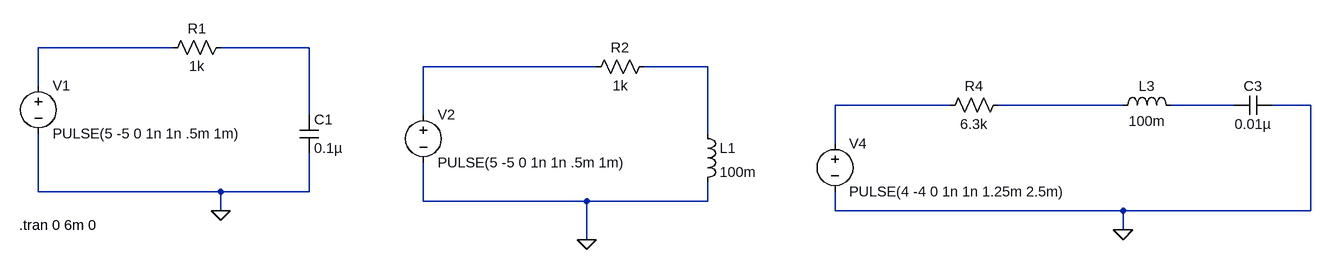
[diagram p0: schematic lab-four-RLC.asc]
lab-four-RLC.asc, the LTspice schematic file:
Version 4.1
SHEET 1 3908 1336
WIRE -176 -80 -400 -80
WIRE 128 -80 -96 -80
WIRE 848 -48 560 -48
WIRE 1104 -48 928 -48
WIRE -400 -16 -400 -80
WIRE 3248 16 3056 16
WIRE 3536 16 3328 16
WIRE 3776 16 3616 16
WIRE 3904 16 3840 16
WIRE 128 32 128 -80
WIRE 560 32 560 -48
WIRE 1104 64 1104 -48
WIRE 3056 80 3056 16
WIRE -400 160 -400 64
WIRE -96 160 -400 160
WIRE 128 160 128 96
WIRE 128 160 -96 160
WIRE 560 176 560 112
WIRE 832 176 560 176
WIRE 1104 176 1104 144
WIRE 1104 176 832 176
WIRE -96 192 -96 160
WIRE 3056 192 3056 160
WIRE 3536 192 3056 192
WIRE 3904 192 3904 16
WIRE 3904 192 3536 192
WIRE 3536 224 3536 192
WIRE 832 240 832 176
FLAG -96 192 0
FLAG 832 240 0
FLAG 3536 224 0
SYMBOL voltage -400 -32 R0
WINDOW 123 0 0 Left 0
WINDOW 39 0 0 Left 0
SYMATTR InstName V1
SYMATTR Value PULSE(5 -5 0 1n 1n .5m 1m)
SYMBOL res -80 -96 R90
WINDOW 0 0 56 VBottom 2
WINDOW 3 32 56 VTop 2
SYMATTR InstName R1
SYMATTR Value 1k
SYMBOL cap 112 32 R0
SYMATTR InstName C1
SYMATTR Value 0.1µ
SYMBOL voltage 560 16 R0
WINDOW 123 0 0 Left 0
WINDOW 39 0 0 Left 0
SYMATTR InstName V2
SYMATTR Value PULSE(5 -5 0 1n 1n .5m 1m)
SYMBOL res 944 -64 R90
WINDOW 0 0 56 VBottom 2
WINDOW 3 32 56 VTop 2
SYMATTR InstName R2
SYMATTR Value 1k
SYMBOL ind 1088 48 R0
SYMATTR InstName L1
SYMATTR Value 100m
SYMATTR SpiceLine Rser=1m
SYMBOL voltage 3056 64 R0
WINDOW 123 0 0 Left 0
WINDOW 39 0 0 Left 0
SYMATTR InstName V4
SYMATTR Value PULSE(4 -4 0 1n 1n 1.25m 2.5m)
SYMBOL res 3344 0 R90
WINDOW 0 0 56 VBottom 2
WINDOW 3 32 56 VTop 2
SYMATTR InstName R4
SYMATTR Value 6.3k
SYMBOL ind 3520 32 R270
WINDOW 0 32 56 VTop 2
WINDOW 3 5 56 VBottom 2
SYMATTR InstName L3
SYMATTR Value 100m
SYMATTR SpiceLine Rser=1m
SYMBOL cap 3840 0 R90
WINDOW 0 0 32 VBottom 2
WINDOW 3 32 32 VTop 2
SYMATTR InstName C3
SYMATTR Value 0.01µ
TEXT -432 216 Left 2 !.tran 0 6m 0

The netlist it stands for:
* lab-four-RLC.asc
V1 N001 0 PULSE(5 -5 0 1n 1n .5m 1m)
R1 N002 N001 1k
C1 N002 0 0.1µ
V2 N003 0 PULSE(5 -5 0 1n 1n .5m 1m)
R2 N004 N003 1k
L1 N004 0 100m Rser=1m
V4 N005 0 PULSE(4 -4 0 1n 1n 1.25m 2.5m)
R4 N006 N005 6.3k
L3 N006 N007 100m Rser=1m
C3 0 N007 0.01µ
.tran 0 6m 0
.backanno
.end